# Altium schematic sheet TSAL.SchDoc: QUTMS - HVBoard V1.1- TSAL
size A3; Author: Jonn Dillon; Organization: QUT Motorsport; Address1: O-120; Address2: O Block; Address3: QUT Gardens Point; Address4: Brisbane, 4000; DocumentNumber: 4; Revision: 2; SheetNumber: 4; SheetTotal: 8
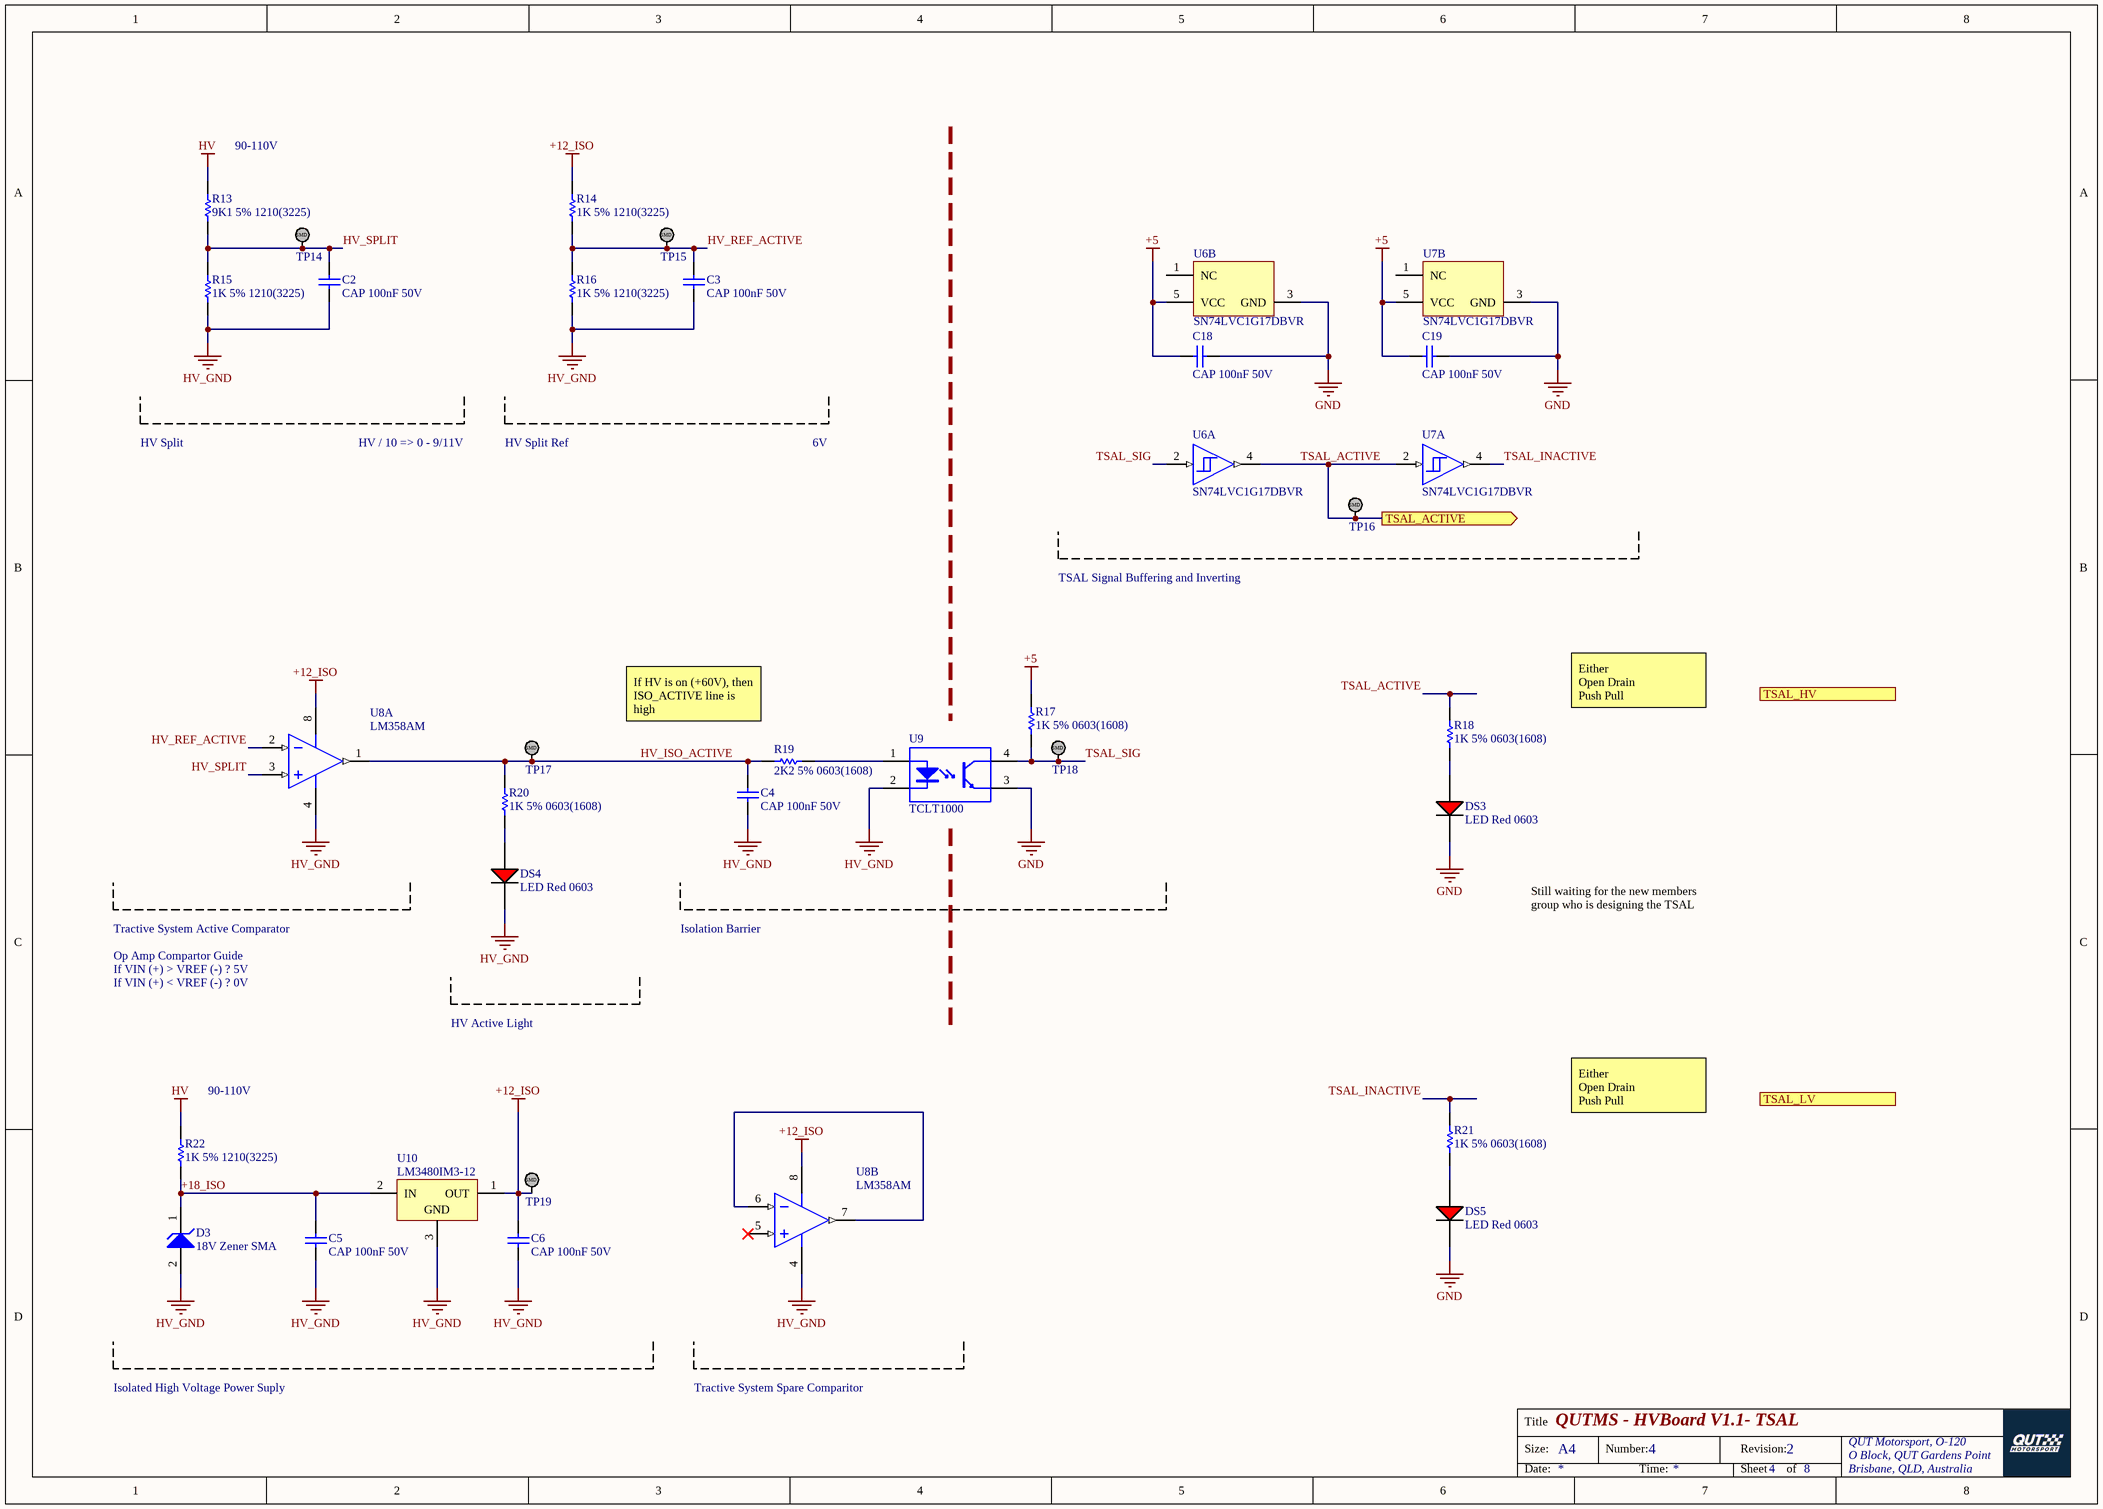
[diagram p0: TSAL.SchDoc]

## Parts
C2  CAP 100nF 50V  [CAPC0603(1608)100_N]
C3  CAP 100nF 50V  [CAPC0603(1608)100_N]
C4  CAP 100nF 50V  [CAPC0603(1608)100_N]
C5  CAP 100nF 50V  [CAPC0603(1608)100_N]
C6  CAP 100nF 50V  [CAPC0603(1608)100_N]
C18  CAP 100nF 50V  [CAPC0603(1608)100_N]
C19  CAP 100nF 50V  [CAPC0603(1608)100_N]
D3  18V Zener SMA  [ONSC-SMA-2-403D-02_F_V]
DS3  LED Red 0603  [LED RED 0603]
DS4  LED Red 0603  [LED RED 0603]
DS5  LED Red 0603  [LED RED 0603]
R13  9K1 5% 1210(3225)  [RESC1210(3225)_N]
R14  1K 5% 1210(3225)  [RESC1210(3225)_N]
R15  1K 5% 1210(3225)  [RESC1210(3225)_N]
R16  1K 5% 1210(3225)  [RESC1210(3225)_N]
R17  1K 5% 0603(1608)  [RESC0603(1608)_L]
R18  1K 5% 0603(1608)  [RESC0603(1608)_N]
R19  2K2 5% 0603(1608)  [RESC0603(1608)_N]
R20  1K 5% 0603(1608)  [RESC0603(1608)_N]
R21  1K 5% 0603(1608)  [RESC0603(1608)_N]
R22  1K 5% 1210(3225)  [RESC1210(3225)_N]
TP14  TestPoint_SMD  [TestPointSMD]  (value not drawn)
TP15  TestPoint_SMD  [TestPointSMD]  (value not drawn)
TP16  TestPoint_SMD  [TestPointSMD]  (value not drawn)
TP17  TestPoint_SMD  [TestPointSMD]  (value not drawn)
TP18  TestPoint_SMD  [TestPointSMD]  (value not drawn)
TP19  TestPoint_SMD  [TestPointSMD]  (value not drawn)
U6  SN74LVC1G17DBVR  [DBV0005A_N]  (parts A,B of 2)
U7  SN74LVC1G17DBVR  [DBV0005A_N]  (parts A,B of 2)
U8  LM358AM  [D0008A_N]  (parts A,B of 2)
U9  TCLT1000  [VISH-SOP4L-4_V]
U10  LM3480IM3-12  [DBZ0003A_N]

## Ports
TSAL_ACTIVE (out), TSAL_HV (out), TSAL_LV (out)

## Nets
+5: C18.1 C19.1 R17.2 U6.5(VCC) U7.5(VCC)
+12_ISO: C6.1 R14.2 TP19.1 U8.8(V+) U10.1(OUT)
GND: C18.2 C19.2 DS3.2(C) DS5.2(C) U6.3(GND) U7.3(GND) U9.3(E)
HV: R13.2 R22.2
HV_GND: C2.2 C3.2 C4.2 C5.2 C6.2 D3.2(A) DS4.2(C) R15.1 R16.1 U8.4(GND) U9.2(C) U10.3(GND)
+18_ISO: C5.1 D3.1(K) R22.1 U10.2(IN)
HV_ISO_ACTIVE: C4.1 R19.2 R20.2 TP17.1 U8.1(OUTA)
HV_REF_ACTIVE: C3.1 R14.1 R16.2 TP15.1 U8.2(INA-)
HV_SPLIT: C2.1 R13.1 R15.2 TP14.1 U8.3(INA+)
TSAL_ACTIVE: R18.2 TP16.1 U6.4(Y) U7.2(A) ; port TSAL_ACTIVE
TSAL_INACTIVE: R21.2 U7.4(Y)
TSAL_SIG: R17.1 TP18.1 U6.2(A) U9.4(C)
NetDS3_1: DS3.1(A) R18.1
NetDS4_1: DS4.1(A) R20.1
NetDS5_1: DS5.1(A) R21.1
NetR19_1: R19.1 U9.1(A)
NetU8_6: U8.6(INB-) U8.7(OUTB)

Not connected (* = marked no-connect by the designer): U6 1(NC); U7 1(NC); U8 5(INB+)*

## Notes on the sheet
- (near R13) 90-110V
- HV Split
- HV / 10 => 0 - 9/11V
- HV Split Ref
- 6V
- TSAL Signal Buffering and Inverting
- If HV is on (+60V), then ISO_ACTIVE line is high
- Either
  Open Drain
  Push Pull
- Still waiting for the new members group who is designing the TSAL
- Tractive System Active Comparator
- If VIN (+) > VREF (-) ? 5V
- If VIN (+) < VREF (-) ? 0V
- Op Amp Compartor Guide
- Isolation Barrier
- HV Active Light
- (near R22) 90-110V
- Isolated High Voltage Power Suply
- Tractive System Spare Comparitor
- Title
- Size:
- A4
- Number:
- Revision:
- QUT Motorsport, O-120
- O Block, QUT Gardens Point
- Date:
- Time:
- Sheet
- of
- Brisbane, QLD, Australia
- (in symbol TestPoint_SMD) SMD

## Library data of the parts
C2-C6 C18 C19 = CMP-1035-02591-1: CAP 100nF 50V ±5% 0603 (1608 Metric) Thickness 1mm SMD; Tolerance: Â±5%; Case-Metric: 1608; Case-EIA: 0603; Rated Voltage: 50 V; Max Thickness: 1 mm; Technology: SMT; Value: 100nF
D3 = CMP-1060-00118-1: 1.5 W Zener Voltage Regulator, 2-Pin SMA, Pb-Free, Tape and Reel; Manufacturer: On Semiconductor; PartNumber: 1SMA5931BT3G; VZ Typ (V): 18; Mounting Technology: Surface Mount; RoHS: Pb-Free; PackageDescription: 2-Pin Small Molded Package, J-Bend Lead, Body 2.605 x 4.315 mm; ComponentLink2Description: Datasheet; DatasheetVersion: Rev. 8; ComponentLink2URL: http://www.onsemi.com/pub_link/Collateral/1SMA5913BT3-D.PDF; ComponentLink3URL: http://www.onsemi.com/pub_link/Collateral/1SMA5913BT3-D.PDF; ComponentLink1URL: http://www.onsemi.com/; ComponentLink1Description: Manufacturer URL; Packing: Tape and Reel; ComponentLink3Description: Package Specification; PackageVersion: Rev. F, 11/2008; PackageReference: SMA-2-403D-02_F
R13 = CMP-1015-00097-1: 9K1 0.5W 5% 1210 (3225 Metric)  SMD; Case-EIA: 1210; Value: 9100.00 Ohm; Case-Metric: 3225; Technology: SMT; Power: 0.5 W; Tolerance: 5 %
R14-R16 R22 = CMP-1015-00074-1: 1K 0.5W 5% 1210 (3225 Metric)  SMD; Case-EIA: 1210; Value: 1000.00 Ohm; Case-Metric: 3225; Power: 0.5 W; Technology: SMT; Tolerance: 5 %
R17 R18 R20 R21 = CMP-1012-00074-1: 1K 0.1W 5% 0603 (1608 Metric)  SMD; Case-EIA: 0603; Case-Metric: 1608; Value: 1000.00 Ohm; Technology: SMT; Tolerance: 5 %; Power: 0.1 W
R19 = CMP-1012-00082-1: 2K2 0.1W 5% 0603 (1608 Metric)  SMD; Case-Metric: 1608; Value: 2200.00 Ohm; Case-EIA: 0603; Power: 0.1 W; Tolerance: 5 %; Technology: SMT
U6 U7 = CMP-0859-00033-4: Single Schmitt-Trigger Buffer, DBV0005A, LARGE T&R; Manufacturer: Texas Instruments; Output Drive (IOL/IOH)(Max)(mA): 32/-32; Technology Family: LVC; ICC @ Nom Voltage(Max)(mA): 0.01; VCC(Min)(V): 1.65; F @ Nom Voltage(Max)(Mhz): 150; Schmitt Trigger: Yes; Voltage(Nom)(V): 1.8,2.5,3.3,5; 3-State Output: No; Bits(#): 1; VCC(Max)(V): 5.5; Input Type: CMOS/TTL; Logic: True; tpd @ Nom Voltage(Max)(ns): 11,6.5,5.5,5; Output Type: CMOS; Rating: Catalog; Sub-Family: Non-Inverting Buffer/Driver; PackageReference: DBV0005A; DatasheetVersion: SCES351V; Generic Part Number: SN74LVC1G17; Operating Temperature Range(C): -40 to 125,-40 to 85
U8 = CMP-0055-00796-3: Low Power Dual Operational Amplifier, 8-pin Narrow SOIC; Manufacturer: Texas Instruments; CompType: Amplifiers; PackageTopMarking: NSZXTT*LM*358AM; PowerWise: N; Code_JEDEC: MS-012-AA; RoHS: N; PinCount: 8; Package Reference: D0008A; ComponentLink1Description: Datasheet URL; ComponentLink1URL: http://www.ti.com/general/docs/lit/getliterature.tsp?genericPartNumber=LM358-N&fileType=pdf; Code_IPC: SOIC127P600-8; PackageDescription: SOIC Narrow, 4.9 x 3.9 x 1.45mm, 8 Lead, 1.27mm Pitch
U9 = CMP-2000-07234-1: Optocoupler, Phototransistor Output, VCEO 70 V, -55 to 100 degC, 4-Pin SOP (SOP4L), RoHS, Tape and Reel; Manufacturer: Vishay/Semiconductor; Maximum Collector Emitter Voltage: 70V; Input Type: DC; Maximum Reverse Voltage: 6V; Maximum Collector Emitter Saturation Voltage: 300mV; Number of Channels per Chip: 1; Maximum Collector Current: 50mA; Maximum Power Dissipation: 250mW; Maximum Forward Voltage: 1.6V; Maximum Input Current: 60mA; Typical Forward Voltage: 1.25V; Minimum Isolation Voltage: 5000Vrms; Maximum Current Transfer Ratio @ Current: 600%; Manufacturer URL: http://www.vishay.com/; Package: 4SOP; Mounting Technology: SurfaceMount; Category: TransistorandPhotovoltaicOutputPhotoCouplers; Datasheet URL: http://www.vishay.com/docs/83515/tclt1000.pdf; Output Type: DC; Operating Temperature: -40to100°C; Package Description: 4-Pin Small Outline Package Integrated Circuit, Body 4.1 x 7.5 mm, Pitch 2.54 mm; Datasheet Version: Rev. 2.9, 12/2015; Package Reference: SOP4L; Packaging: Tape&Reel
U10 = CMP-0062-02197-3: 100 mA, Quasi Low-Dropout Linear Voltage Regulator, 3-pin SOT-23, Pb-Free; Manufacturer: Texas Instruments; PackageTopMarking: L0C*XTT; CompType: LDO IC; PowerWise: N; PackageDescription: Molded SOT-23, .115 x .051 x .037in Body, 3 Lead, .075 in Pitch; ComponentLink1Description: Datasheet URL; PackageReference: DBZ0003A; ComponentLink1URL: http://www.ti.com/general/docs/lit/getliterature.tsp?genericPartNumber=LM3480&fileType=pdf; RoHS: Y; PinCount: 3